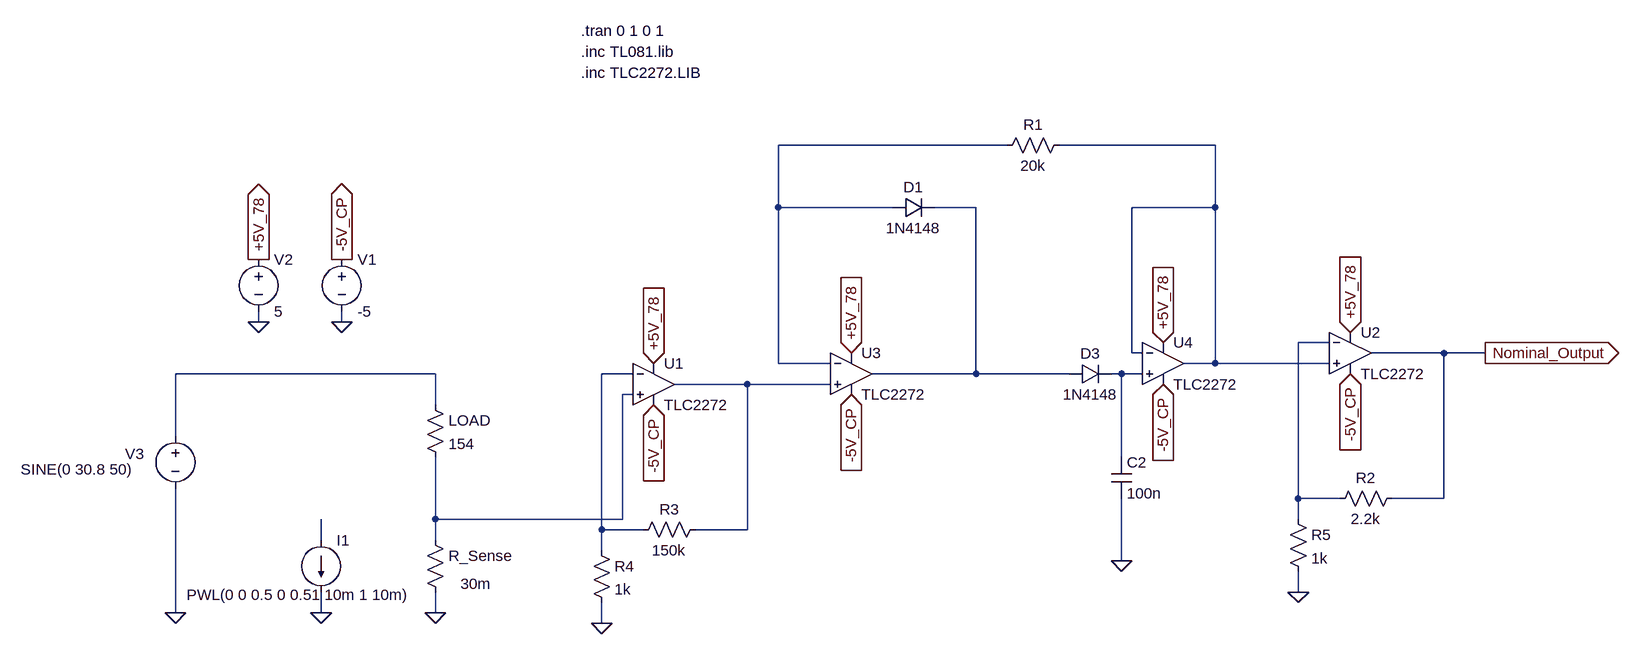
[diagram p0: schematic CurrentSensing.asc]
CurrentSensing.asc, the LTspice schematic file:
Version 4
SHEET 1 2516 1588
WIRE -400 -64 -752 -64
WIRE -80 -64 -320 -64
WIRE -752 32 -752 -64
WIRE -576 32 -752 32
WIRE -448 32 -512 32
WIRE -80 32 -80 -64
WIRE -80 32 -208 32
WIRE -1552 208 -1552 192
WIRE -1424 208 -1424 192
WIRE 96 240 48 240
WIRE -208 256 -208 32
WIRE -192 256 -208 256
WIRE 272 256 160 256
WIRE 336 256 272 256
WIRE -752 272 -752 32
WIRE -672 272 -752 272
WIRE -80 272 -80 32
WIRE -80 272 -128 272
WIRE 96 272 -80 272
WIRE -1280 288 -1680 288
WIRE -976 288 -1024 288
WIRE -448 288 -448 32
WIRE -448 288 -608 288
WIRE -304 288 -448 288
WIRE -224 288 -240 288
WIRE -192 288 -224 288
WIRE -800 304 -912 304
WIRE -672 304 -800 304
WIRE -976 320 -992 320
WIRE -1280 336 -1280 288
WIRE -1680 384 -1680 288
WIRE -224 416 -224 288
WIRE 48 480 48 240
WIRE 112 480 48 480
WIRE 272 480 272 256
WIRE 272 480 192 480
WIRE -1280 512 -1280 416
WIRE -992 512 -992 320
WIRE -992 512 -1280 512
WIRE 48 512 48 480
WIRE -1024 528 -1024 288
WIRE -960 528 -1024 528
WIRE -800 528 -800 304
WIRE -800 528 -880 528
WIRE -1456 544 -1456 512
WIRE -1280 544 -1280 512
WIRE -1024 560 -1024 528
WIRE -224 576 -224 480
WIRE 48 624 48 592
WIRE -1680 656 -1680 464
WIRE -1456 656 -1456 624
WIRE -1280 656 -1280 624
WIRE -1024 672 -1024 640
FLAG -1552 208 0
FLAG -1552 112 +5V_78
IOPIN -1552 112 Out
FLAG -1280 656 0
FLAG -1424 208 0
FLAG -1424 112 -5V_CP
IOPIN -1424 112 Out
FLAG -944 336 -5V_CP
IOPIN -944 336 In
FLAG -944 272 +5V_78
IOPIN -944 272 In
FLAG -1024 672 0
FLAG -224 576 0
FLAG -640 256 +5V_78
IOPIN -640 256 In
FLAG -640 320 -5V_CP
IOPIN -640 320 In
FLAG 128 288 -5V_CP
IOPIN 128 288 In
FLAG 128 224 +5V_78
IOPIN 128 224 In
FLAG 48 624 0
FLAG -160 240 +5V_78
IOPIN -160 240 In
FLAG -160 304 -5V_CP
IOPIN -160 304 In
FLAG -1680 656 0
FLAG -1456 656 0
FLAG 336 256 Nominal_Output
IOPIN 336 256 Out
SYMBOL voltage -1680 368 R0
WINDOW 123 0 0 Left 2
WINDOW 39 0 0 Left 2
WINDOW 0 -77 43 Left 2
WINDOW 3 -238 67 Left 2
SYMATTR InstName V3
SYMATTR Value SINE(0 30.8 50)
SYMBOL voltage -1552 96 R0
WINDOW 123 0 0 Left 2
WINDOW 39 0 0 Left 2
SYMATTR InstName V2
SYMATTR Value 5
SYMBOL res -1296 320 R0
SYMATTR InstName LOAD
SYMATTR Value 154
SYMBOL res -1296 528 R0
WINDOW 3 55 83 Left 2
SYMATTR Value 30m
SYMATTR InstName R_Sense
SYMBOL voltage -1424 96 R0
WINDOW 123 0 0 Left 2
WINDOW 39 0 0 Left 2
SYMATTR InstName V1
SYMATTR Value -5
SYMBOL Opamps\\opamp2 -944 240 R0
SYMATTR InstName U1
SYMATTR Value TLC2272
SYMBOL res -864 512 R90
WINDOW 0 0 56 VBottom 2
WINDOW 3 32 56 VTop 2
SYMATTR InstName R3
SYMATTR Value 150k
SYMBOL res -1040 544 R0
SYMATTR InstName R4
SYMATTR Value 1k
SYMBOL cap -240 416 R0
SYMATTR InstName C2
SYMATTR Value 100n
SYMBOL Opamps\\opamp2 -640 224 R0
SYMATTR InstName U3
SYMATTR Value TLC2272
SYMBOL diode -304 304 R270
WINDOW 0 32 32 VTop 2
WINDOW 3 0 32 VBottom 2
SYMATTR InstName D3
SYMATTR Value 1N4148
SYMBOL Opamps\\opamp2 128 192 R0
SYMATTR InstName U2
SYMATTR Value TLC2272
SYMBOL res 208 464 R90
WINDOW 0 0 56 VBottom 2
WINDOW 3 32 56 VTop 2
SYMATTR InstName R2
SYMATTR Value 2.2k
SYMBOL res 32 496 R0
SYMATTR InstName R5
SYMATTR Value 1k
SYMBOL diode -576 48 R270
WINDOW 0 32 32 VTop 2
WINDOW 3 0 32 VBottom 2
SYMATTR InstName D1
SYMATTR Value 1N4148
SYMBOL Opamps\\opamp2 -160 208 R0
SYMATTR InstName U4
SYMATTR Value TLC2272
SYMBOL res -304 -80 R90
WINDOW 0 0 56 VBottom 2
WINDOW 3 32 56 VTop 2
SYMATTR InstName R1
SYMATTR Value 20k
SYMBOL current -1456 544 R0
WINDOW 123 0 0 Left 0
WINDOW 39 0 0 Left 0
WINDOW 3 -207 84 Left 2
SYMATTR Value PWL(0 0 0.5 0 0.51 10m 1 10m)
SYMATTR InstName I1
TEXT -1056 -208 Left 2 !.inc TL081.lib
TEXT -1056 -176 Left 2 !.inc TLC2272.LIB
TEXT -1056 -240 Left 2 !.tran 0 1 0 1

The netlist it stands for:
* CurrentSensing.asc
V3 N005 0 SINE(0 30.8 50)
V2 +5V_78 0 5
R§LOAD N005 N009 154
R_Sense N009 0 30m
V1 -5V_CP 0 -5
XU1 N009 N006 +5V_78 -5V_CP N008 TLC2272  ; pins In+ In- V+ V- OUT
R3 N008 N006 150k
R4 N006 0 1k
C2 N007 0 100n
XU3 N008 N001 +5V_78 -5V_CP N003 TLC2272  ; pins In+ In- V+ V- OUT
D3 N003 N007 1N4148
XU2 N002 N004 +5V_78 -5V_CP Nominal_Output TLC2272  ; pins In+ In- V+ V- OUT
R2 Nominal_Output N004 2.2k
R5 N004 0 1k
D1 N001 N003 1N4148
XU4 N007 N002 +5V_78 -5V_CP N002 TLC2272  ; pins In+ In- V+ V- OUT
R1 N002 N001 20k
I1 N010 0 PWL(0 0 0.5 0 0.51 10m 1 10m)
.model D D
.lib standard.dio
.inc TL081.lib
.inc TLC2272.LIB
.tran 0 1 0 1
.backanno
.end